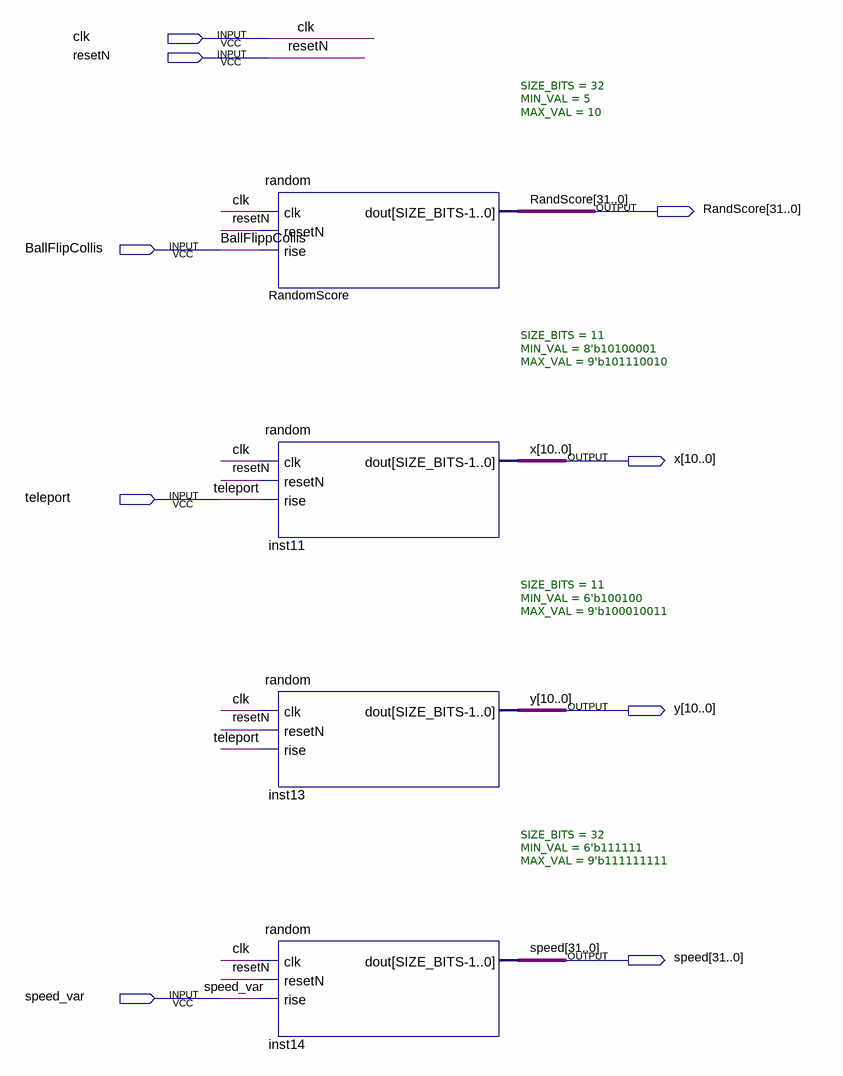
[diagram p0: schematic sheet]
// Quartus schematic RandomBlock.bdf as structural Verilog: 4 symbols, 9 pins
module RandomBlock (
  input  clk,
  input  resetN,
  input  BallFlipCollis,
  input  teleport,
  input  speed_var,
  output [31:0] RandScore,
  output [10:0] x,
  output [10:0] y,
  output [31:0] speed
);

  random #(.SIZE_BITS(32), .MIN_VAL(5), .MAX_VAL(10)) RandomScore (
    .clk(clk), .resetN(resetN), .rise(BallFlipCollis), .dout(RandScore));
  random #(.SIZE_BITS(11), .MIN_VAL(8'b10100001), .MAX_VAL(9'b101110010)) inst11 (
    .clk(clk), .resetN(resetN), .rise(teleport), .dout(x));
  random #(.SIZE_BITS(11), .MIN_VAL(6'b100100), .MAX_VAL(9'b100010011)) inst13 (
    .clk(clk), .resetN(resetN), .rise(teleport), .dout(y));
  random #(.SIZE_BITS(32), .MIN_VAL(6'b111111), .MAX_VAL(9'b111111111)) inst14 (
    .clk(clk), .resetN(resetN), .rise(speed_var), .dout(speed));

  // Other names for the same wires on the sheet: BallFlippCollis = BallFlipCollis
endmodule
